# Altium project PowerBoard.PrjPcb
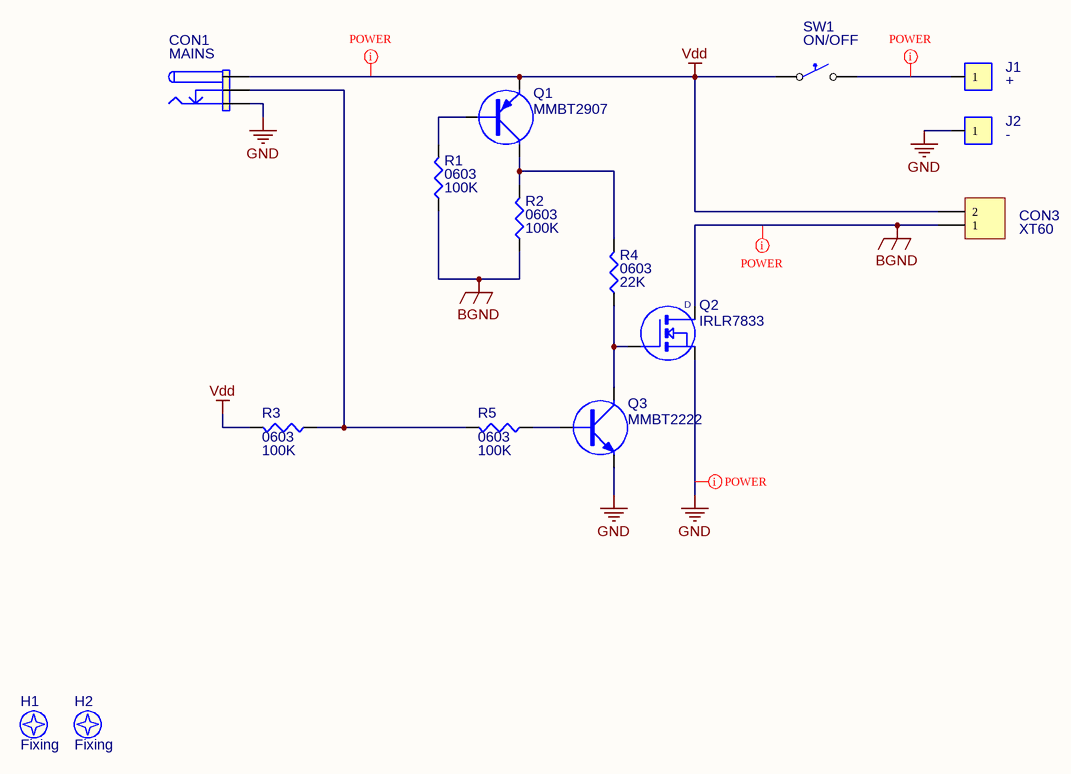
[diagram p0: PowerBoard.SchDoc]
1 sheet, 15 parts. Net scope: global (net labels, ports and power ports of the same name join across sheets).
Board file: PowerBoard.PcbDoc

## Sheet PowerBoard.SchDoc
size A4; PageSetup: Record=PageOptions|CenterHorizontal=True|CenterVertical=True|PrintScale=0.97|XCorrection=1.00|YCorrection=1.00|PrintKind=2|BorderSize=5000000|LeftOffset=0|BottomOffset=0|Orientation=2|PaperLength=1000|PaperWidth=1000|Scale=100|PaperSource=7|PrintQuality=-3|MediaType=1|DitherType=10|PrintScaleMode=1|PaperKind=A4|PaperIndex=9

### Parts
CON1  MAINS  [PCB-DC-SOCKET]
CON3  XT60  [CON-XT60]
H1  Fixing  [HW-FIXING-2.5MM-PLASTIC]
H2  Fixing  [HW-FIXING-2.5MM-PLASTIC]
J1  +  [TESTPOINT(LB)]
J2  -  [TESTPOINT(LB)]
Q1  MMBT2907  [SOT-23(LB)]
Q2  IRLR7833  [TO-252(LB)]
Q3  MMBT2222  [SOT-23(LB)]
R1  0603  value 100K  [0603(LB)]
R2  0603  value 100K  [0603(LB)]
R3  0603  value 100K  [0603(LB)]
R4  0603  value 22K  [0603(LB)]
R5  0603  value 100K  [0603(LB)]
SW1  ON/OFF  [PCB-SWSPDT-ROCKER]

### Nets
BGND: CON3.1 Q2.3(D) R1.1 R2.1
GND: CON1.3(Body) J2.1 Q2.2(S) Q3.2(E)
Vdd: CON1.1(TIP) CON3.2 Q1.2(E) R3.2 SW1.1(COM)
NetCON1_2: CON1.2(SWITCHED-BODY) R3.1 R5.2
NetJ1_1: J1.1 SW1.2(NO)
NetQ1_1: Q1.1(B) R1.2
NetQ1_3: Q1.3(C) R2.2 R4.2
NetQ2_1: Q2.1(G) Q3.3(C) R4.1
NetQ3_1: Q3.1(B) R5.1

### Layout directives
net class VDD: BGND, GND, NetJ1_1, Vdd

### Library data of the parts
CON1 = DC2.5MM-PCBV(LB): Switched 2.5mm DC Connector - PCB; EMRP: JP-2.5MM-PAN
CON3 = XT60: XT60 Connector; LatestRevisionDate: 17-Jul-2002; LatestRevisionNote: Re-released for DXP Platform.; Publisher: Altium Limited
H1 H2 = HW-FIXING-ISOLATED(LB): M3/M4 Fixing Hole; EMRP: NA
J1 J2 = CON1(LB)
Q1 = MMBT2907(SMD): PNP Transistor; EMRP: SM-T-MMBT2907
Q2 = IRLR7833(LB): EMRP: SM-T-IRLR7833
Q3 = MMBT2222(SMD): NPN Transistor; EMRP: SM-T-MMBT2222
R1-R5 = Res3: Resistor; Published: 8-Jun-2000; LatestRevisionDate: 29-May-2009; LatestRevisionNote: IPC-7351 Footprint Added.; PackageReference: J1-0603; Publisher: Altium Limited; PackageDescription: Chip Resistor
SW1 = SW-SPST(LB): Single-pole Single-throw Switch; Text Field1: OriginalName SW-SPST; Text Field2: Description; Datasheet: http://cherryswitches.com/us/wp-content/uploads/sites/7/2013/12/Rocker_PR_PPR.pdf